# Altium schematic sheet digital_host_for_ADS1216_SPI_connecor_to_ADS1216.SchDoc
size 420 x 297 mm; Address1: Address1; Address2: Address2; Address3: Address3; Address4: Address4; SheetNumber: 1; Scale: 1:1; Разраб.: Иванов; Обозначение документа: АБВГ.123456.001 Э3; Пров.: Петров; Утв.: Сидоров; Наименование организации: ОАО "Концерн "МПО-Гидроприбор"; Перв. применение: АБВГ.123456.000; Наименование изделия 1: Плата; Наименование изделия 2: Схема электрическая; Наименование изделия 3: принципиальная; Нач. отд.: Нач. отд.; Фамилия нач. отд.: Сидоров
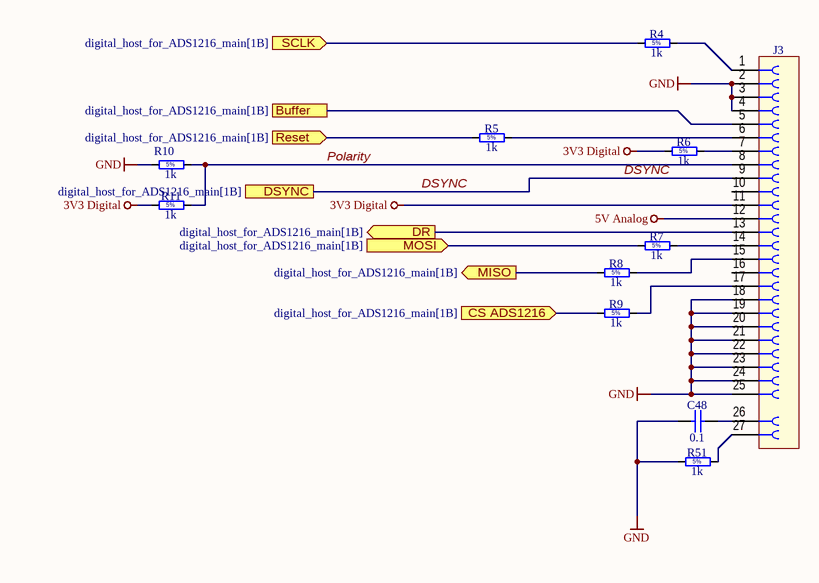
[diagram p0: digital_host_for_ADS1216_SPI_connecor_to_ADS1216.SchDoc]

## Parts
C48  0.1  [CAPC2012X90N]
J3  (no value)  [TYCO_3-1634586-2]
R4  1k  [RESC2012X70N]
R5  1k  [RESC2012X70N]
R6  1k  [RESC2012X70N]
R7  1k  [RESC2012X70N]
R8  1k  [RESC2012X70N]
R9  1k  [RESC2012X70N]
R10  1k  [RESC2012X70N]
R11  1k  [RESC2012X70N]
R51  1k  [RESC2012X70N]

## Ports
Buffer (see digital_host_for_ADS1216_main[1B]), CS ADS1216 (in, see digital_host_for_ADS1216_main[1B]), DR (out, see digital_host_for_ADS1216_main[1B]), DSYNC (see digital_host_for_ADS1216_main[1B]), MISO (out, see digital_host_for_ADS1216_main[1B]), MOSI (in, see digital_host_for_ADS1216_main[1B]), Reset (in, see digital_host_for_ADS1216_main[1B]), SCLK (in, see digital_host_for_ADS1216_main[1B])

## Nets
3V3 Digital: J3.11 R6.1 R11.2
5V Analog: J3.12
GND: C48.1 J3.2 J3.3 J3.4 J3.18 J3.19 J3.20 J3.21 J3.22 J3.23 J3.24 J3.25 R10.2 R51.1
Buffer: J3.5 ; port Buffer
CS ADS1216: R9.1 ; port CS ADS1216
DR: J3.13 ; port DR
DSYNC: J3.9 ; port DSYNC
MISO: R8.1 ; port MISO
MOSI: R7.1 ; port MOSI
Polarity: J3.8 R10.1 R11.1
Reset: R5.1 ; port Reset
SCLK: R4.1 ; port SCLK
NetC48_2: C48.2 J3.26
NetJ3_1: J3.1 R4.2
NetJ3_6: J3.6 R5.2
NetJ3_7: J3.7 R6.2
NetJ3_14: J3.14 R7.2
NetJ3_15: J3.15 R8.2
NetJ3_17: J3.17 R9.2
NetJ3_27: J3.27 R51.2

Not connected (* = marked no-connect by the designer): J3 10 16

## Notes on the sheet
- Перв. примен.
- Справ. №
- Подп. и дата
- Инв. № дубл.
- Взам. инв. №
- Разраб.
- Изм.
- Лист
- № докум.
- Подп.
- Дата
- Лит.
- Масса
- Масштаб
- Пров.
- Т.контр.
- Листов
- Инв. № подл.
- Утв.
- Н.контр.
- Копировал
- Формат А3

## Library data of the parts
C48 = Capacitor - non polarized: Non-polarised capacitor2012; SolderOption: 0; SMD Solders: 2; Dielectric type: X5R; Vendor: any; Value: 0.1; THD Solders: 0
J3 = Connector 25 Female: Solder Option: 0; THD Solders: 25; SMD Solders: 0; Vendor: *; Value: *
R4-R11 R51 = Resistor - 5%: Vendor: any; SMD Solders: 2; THD Solders: 0; TK: 1000ppmC^(-1); Value: 1k; SolderOption: 0; Tolerance: 5%